# Altium schematic sheet TCU.SchDoc
size A; SheetNumber: 1; SheetTotal: 10
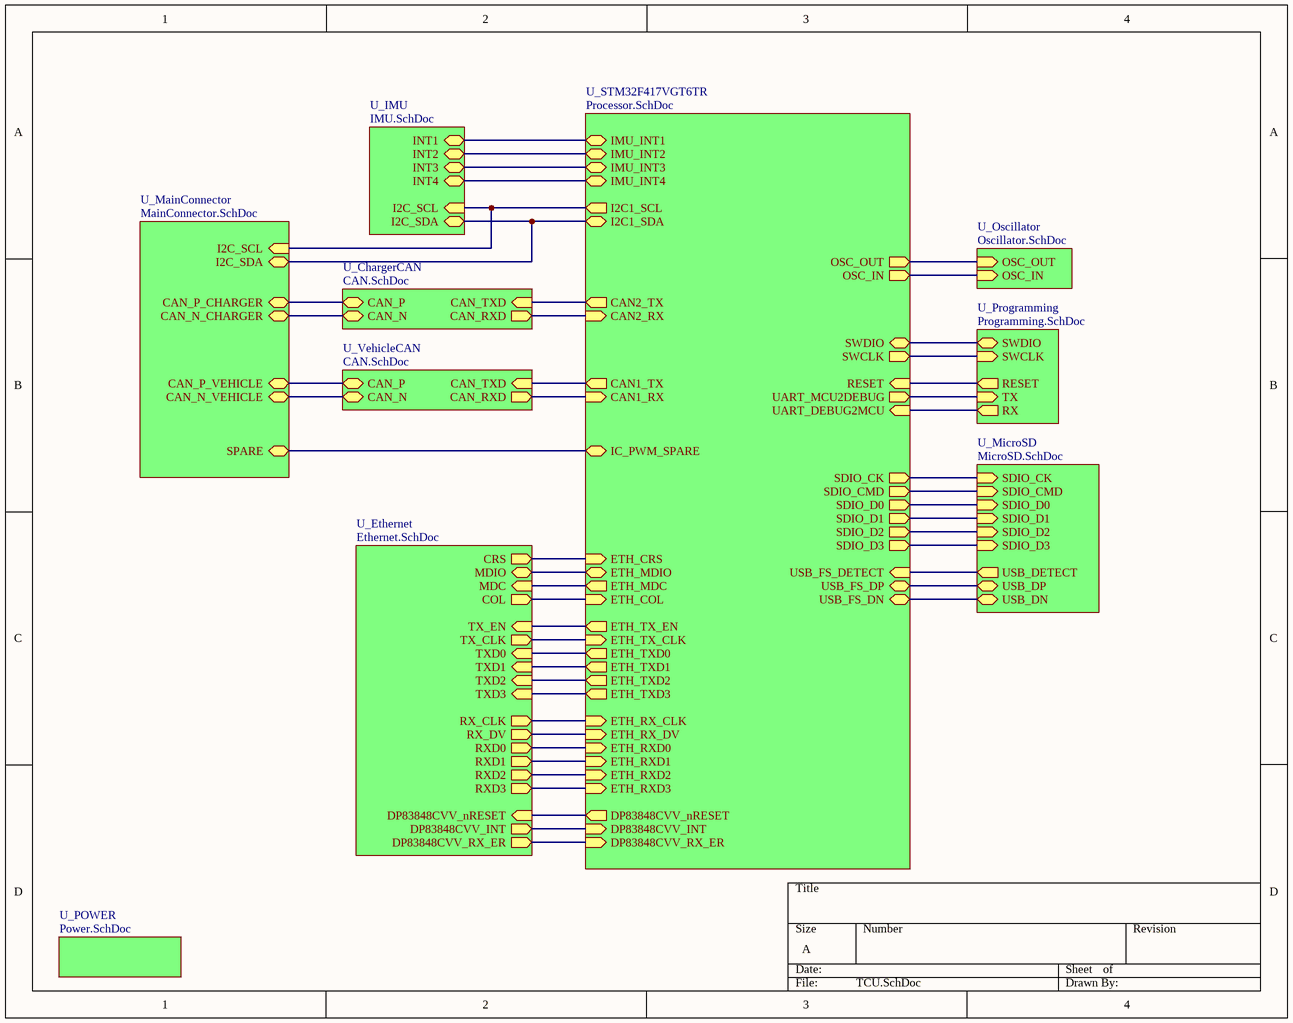
[diagram p0: TCU.SchDoc]

## Sub-sheets
U_ChargerCAN = CAN.SchDoc: CAN_P (bidir), CAN_N (bidir), CAN_TXD (in), CAN_RXD (out)
U_Ethernet = Ethernet.SchDoc: DP83848CVV_INT (out), DP83848CVV_nRESET (in), CRS (out), RX_CLK (out), MDIO (bidir), COL (out), RX_DV (out), RXD2 (out), RXD3 (out), TX_EN (in), TXD0 (in), TXD1 (in), MDC (in), TXD2 (in), TX_CLK (out), RXD0 (out), RXD1 (out), TXD3 (in), DP83848CVV_RX_ER (out)
U_IMU = IMU.SchDoc: INT1 (bidir), INT2 (bidir), INT3 (bidir), INT4 (bidir), I2C_SDA (bidir), I2C_SCL (in)
U_MainConnector = MainConnector.SchDoc: CAN_P_VEHICLE (bidir), CAN_N_VEHICLE (bidir), CAN_P_CHARGER (bidir), CAN_N_CHARGER (bidir), I2C_SCL (in), I2C_SDA (bidir), SPARE (bidir)
U_MicroSD = MicroSD.SchDoc: SDIO_CK (in), SDIO_CMD (in), SDIO_D0 (in), SDIO_D1 (in), SDIO_D2 (in), SDIO_D3 (in), USB_DETECT (out), USB_DN (bidir), USB_DP (bidir)
U_Oscillator = Oscillator.SchDoc: OSC_IN (in), OSC_OUT (in)
U_POWER = Power.SchDoc: no entries
U_Programming = Programming.SchDoc: SWDIO (bidir), SWCLK (in), RESET (out), TX (in), RX (out)
U_STM32F417VGT6TR = Processor.SchDoc: OSC_OUT (out), OSC_IN (out), CAN1_TX (out), CAN1_RX (in), SWDIO (bidir), SWCLK (out), RESET (in), UART_MCU2DEBUG (out), UART_DEBUG2MCU (in), SDIO_CK (out), SDIO_CMD (out), SDIO_D0 (out), SDIO_D1 (out), SDIO_D2 (out), SDIO_D3 (out), USB_FS_DETECT (in), USB_FS_DP (bidir), USB_FS_DN (bidir), I2C1_SCL (out), I2C1_SDA (bidir), IMU_INT1 (bidir), IMU_INT2 (bidir), IMU_INT3 (bidir), IMU_INT4 (bidir), CAN2_RX (in), CAN2_TX (out), ETH_MDC (out), ETH_MDIO (bidir), DP83848CVV_INT (in), DP83848CVV_nRESET (out), ETH_COL (in), ETH_CRS (in), ETH_RXD0 (in), ETH_RXD1 (in), ETH_RXD2 (in), ETH_RXD3 (in), ETH_RX_CLK (in), ETH_RX_DV (in), ETH_TXD0 (out), ETH_TXD1 (out), ETH_TXD2 (out), ETH_TXD3 (out), ETH_TX_CLK (in), ETH_TX_EN (out), DP83848CVV_RX_ER (in), IC_PWM_SPARE (bidir)
U_VehicleCAN = CAN.SchDoc: CAN_P (bidir), CAN_N (bidir), CAN_TXD (in), CAN_RXD (out)

## Nets
(unnamed): sheet U_MicroSD/SDIO_CK, sheet U_STM32F417VGT6TR/SDIO_CK
(unnamed): sheet U_MicroSD/SDIO_CMD, sheet U_STM32F417VGT6TR/SDIO_CMD
(unnamed): sheet U_MicroSD/SDIO_D0, sheet U_STM32F417VGT6TR/SDIO_D0
(unnamed): sheet U_MicroSD/SDIO_D1, sheet U_STM32F417VGT6TR/SDIO_D1
(unnamed): sheet U_MicroSD/SDIO_D2, sheet U_STM32F417VGT6TR/SDIO_D2
(unnamed): sheet U_MicroSD/SDIO_D3, sheet U_STM32F417VGT6TR/SDIO_D3
(unnamed): sheet U_MicroSD/USB_DETECT, sheet U_STM32F417VGT6TR/USB_FS_DETECT
(unnamed): sheet U_MicroSD/USB_DN, sheet U_STM32F417VGT6TR/USB_FS_DN
(unnamed): sheet U_MicroSD/USB_DP, sheet U_STM32F417VGT6TR/USB_FS_DP
(unnamed): sheet U_Programming/SWDIO, sheet U_STM32F417VGT6TR/SWDIO
(unnamed): sheet U_Programming/SWCLK, sheet U_STM32F417VGT6TR/SWCLK
(unnamed): sheet U_Programming/RESET, sheet U_STM32F417VGT6TR/RESET
(unnamed): sheet U_Programming/TX, sheet U_STM32F417VGT6TR/UART_MCU2DEBUG
(unnamed): sheet U_Programming/RX, sheet U_STM32F417VGT6TR/UART_DEBUG2MCU
(unnamed): sheet U_VehicleCAN/CAN_P, sheet U_MainConnector/CAN_P_VEHICLE
(unnamed): sheet U_VehicleCAN/CAN_N, sheet U_MainConnector/CAN_N_VEHICLE
(unnamed): sheet U_VehicleCAN/CAN_TXD, sheet U_STM32F417VGT6TR/CAN1_TX
(unnamed): sheet U_VehicleCAN/CAN_RXD, sheet U_STM32F417VGT6TR/CAN1_RX
(unnamed): sheet U_Oscillator/OSC_IN, sheet U_STM32F417VGT6TR/OSC_IN
(unnamed): sheet U_Oscillator/OSC_OUT, sheet U_STM32F417VGT6TR/OSC_OUT
(unnamed): sheet U_STM32F417VGT6TR/I2C1_SCL, sheet U_MainConnector/I2C_SCL, sheet U_IMU/I2C_SCL
(unnamed): sheet U_STM32F417VGT6TR/I2C1_SDA, sheet U_MainConnector/I2C_SDA, sheet U_IMU/I2C_SDA
(unnamed): sheet U_STM32F417VGT6TR/IMU_INT1, sheet U_IMU/INT1
(unnamed): sheet U_STM32F417VGT6TR/IMU_INT2, sheet U_IMU/INT2
(unnamed): sheet U_STM32F417VGT6TR/IMU_INT3, sheet U_IMU/INT3
(unnamed): sheet U_STM32F417VGT6TR/IMU_INT4, sheet U_IMU/INT4
(unnamed): sheet U_STM32F417VGT6TR/CAN2_RX, sheet U_ChargerCAN/CAN_RXD
(unnamed): sheet U_STM32F417VGT6TR/CAN2_TX, sheet U_ChargerCAN/CAN_TXD
(unnamed): sheet U_STM32F417VGT6TR/ETH_MDC, sheet U_Ethernet/MDC
(unnamed): sheet U_STM32F417VGT6TR/ETH_MDIO, sheet U_Ethernet/MDIO
(unnamed): sheet U_STM32F417VGT6TR/DP83848CVV_INT, sheet U_Ethernet/DP83848CVV_INT
(unnamed): sheet U_STM32F417VGT6TR/DP83848CVV_nRESET, sheet U_Ethernet/DP83848CVV_nRESET
(unnamed): sheet U_STM32F417VGT6TR/ETH_COL, sheet U_Ethernet/COL
(unnamed): sheet U_STM32F417VGT6TR/ETH_CRS, sheet U_Ethernet/CRS
(unnamed): sheet U_STM32F417VGT6TR/ETH_RXD0, sheet U_Ethernet/RXD0
(unnamed): sheet U_STM32F417VGT6TR/ETH_RXD1, sheet U_Ethernet/RXD1
(unnamed): sheet U_STM32F417VGT6TR/ETH_RXD2, sheet U_Ethernet/RXD2
(unnamed): sheet U_STM32F417VGT6TR/ETH_RXD3, sheet U_Ethernet/RXD3
(unnamed): sheet U_STM32F417VGT6TR/ETH_RX_CLK, sheet U_Ethernet/RX_CLK
(unnamed): sheet U_STM32F417VGT6TR/ETH_RX_DV, sheet U_Ethernet/RX_DV
(unnamed): sheet U_STM32F417VGT6TR/ETH_TXD0, sheet U_Ethernet/TXD0
(unnamed): sheet U_STM32F417VGT6TR/ETH_TXD1, sheet U_Ethernet/TXD1
(unnamed): sheet U_STM32F417VGT6TR/ETH_TXD2, sheet U_Ethernet/TXD2
(unnamed): sheet U_STM32F417VGT6TR/ETH_TXD3, sheet U_Ethernet/TXD3
(unnamed): sheet U_STM32F417VGT6TR/ETH_TX_CLK, sheet U_Ethernet/TX_CLK
(unnamed): sheet U_STM32F417VGT6TR/ETH_TX_EN, sheet U_Ethernet/TX_EN
(unnamed): sheet U_STM32F417VGT6TR/DP83848CVV_RX_ER, sheet U_Ethernet/DP83848CVV_RX_ER
(unnamed): sheet U_STM32F417VGT6TR/IC_PWM_SPARE, sheet U_MainConnector/SPARE
(unnamed): sheet U_MainConnector/CAN_P_CHARGER, sheet U_ChargerCAN/CAN_P
(unnamed): sheet U_MainConnector/CAN_N_CHARGER, sheet U_ChargerCAN/CAN_N